# Altium schematic sheet OptoIsolator.SchDoc
size A4
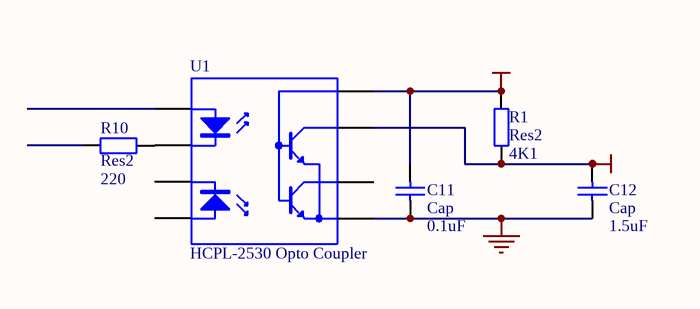
[diagram p0: OptoIsolator.SchDoc]

## Parts
C11  Cap  value 0.1uF  [RAD-0.3]
C12  Cap  value 1.5uF  [RAD-0.3]
R1  Res2  value 4K1  [AXIAL-0.4]
R10  Res2  value 220  [AXIAL-0.4]
U1  HCPL-2530 Opto Coupler  [8P3]

## Nets
GND: C11.1 C12.1 U1.5(E)
VCC: C11.2 R1.2 U1.8(E)
Vout: C12.2 R1.1 U1.7(C)
NetR10_2: R10.2 U1.2(K)

Not connected (* = marked no-connect by the designer): R10 1; U1 1(A) 3(K) 4(A) 6(C)

## Library data of the parts
C11 C12 = Cap: Capacitor; Published: 8-Jun-2000; Revision: July-2002: Re-released for DXP Platform.; Publisher: Altium Limited
R1 R10 = Res2: Resistor; Published: 8-Jun-2000; Revision: July-2002: Re-released for DXP Platform.; Publisher: Altium Limited
U1 = HCPL-2530